# Altium schematic sheet USB_UART.SchDoc
size A; SheetNumber: 3; SheetTotal: 5
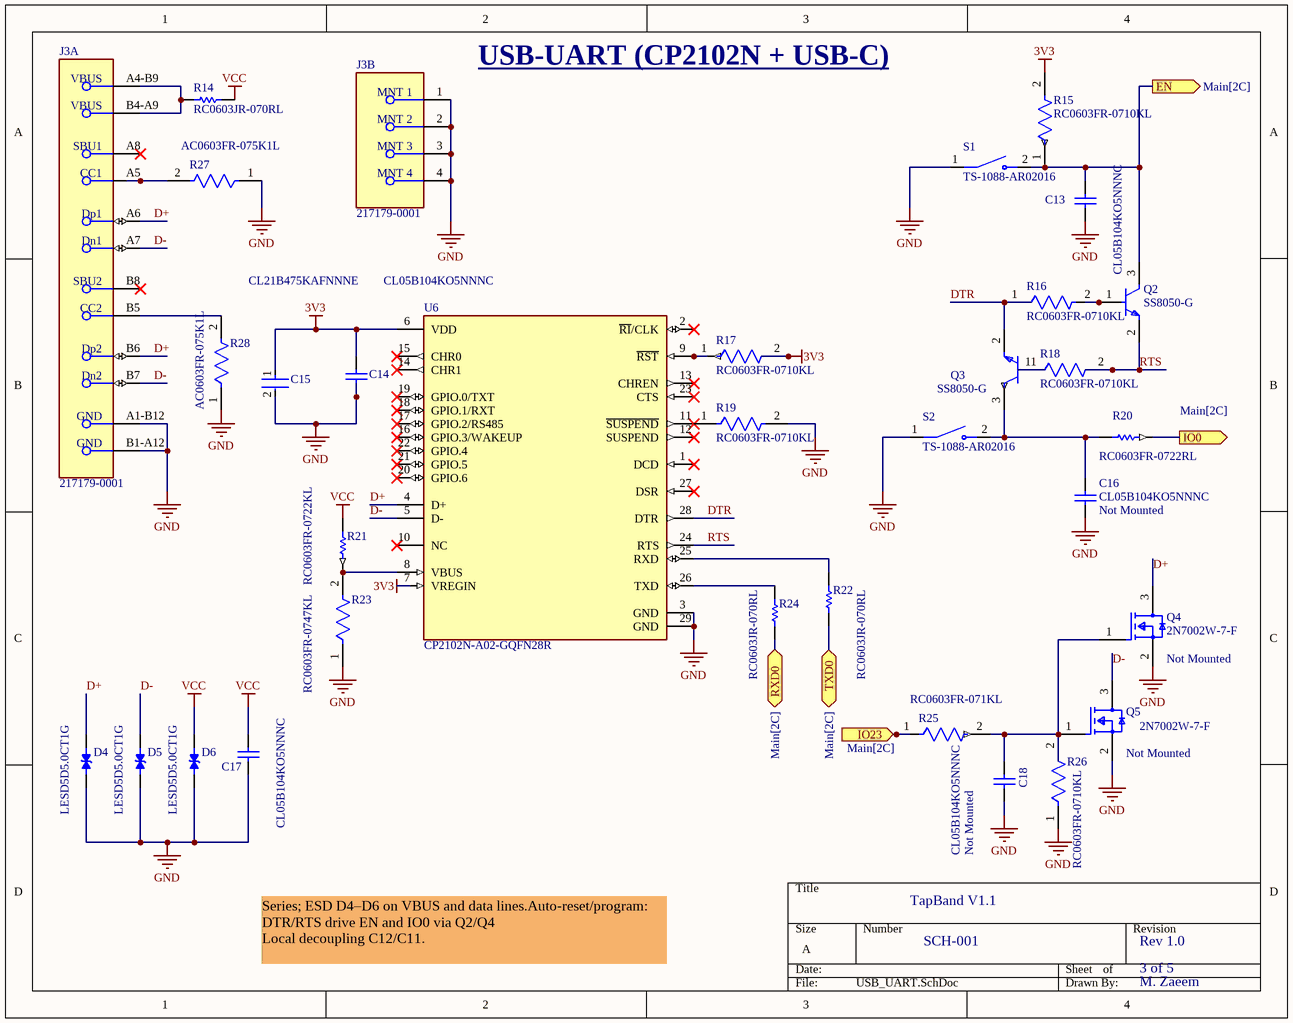
[diagram p0: USB_UART.SchDoc]

## Parts
C13  CL05B104KO5NNNC  [CAPC1050X55X23ML05T13]
C14  CL05B104KO5NNNC  [CAPC1050X55X23ML05T13]
C15  CL21B475KAFNNNE  [FP-CL21-IPC_C]
C16  CL05B104KO5NNNC  Fitted: Not Mounted  [CAPC1050X55X23ML05T13]
C17  CL05B104KO5NNNC  [CAPC1050X55X23ML05T13]
C18  CL05B104KO5NNNC  Fitted: Not Mounted  [CAPC1050X55X23ML05T13]
D4  LESD5D5.0CT1G  [TVS_LESD5D5.0CT1G]
D5  LESD5D5.0CT1G  [TVS_LESD5D5.0CT1G]
D6  LESD5D5.0CT1G  [TVS_LESD5D5.0CT1G]
J3  217179-0001  [FP-2171790001-MFG]  (parts A,B of 2)
Q2  SS8050-G  [FP-SS8050-G-MFG]
Q3  SS8050-G  [FP-SS8050-G-MFG]
Q4  2N7002W-7-F  Fitted: Not Mounted  [FP-SOT323-IPC_C]
Q5  2N7002W-7-F  Fitted: Not Mounted  [FP-SOT323-IPC_C]
R14  RC0603JR-070RL  [RESC1608X55X25ML10T15]
R15  RC0603FR-0710KL  [FP-RC0603-0_55-IPC_C]
R16  RC0603FR-0710KL  [FP-RC0603-0_55-IPC_C]
R17  RC0603FR-0710KL  [FP-RC0603-0_55-IPC_C]
R18  RC0603FR-0710KL  [FP-RC0603-0_55-IPC_C]
R19  RC0603FR-0710KL  [FP-RC0603-0_55-IPC_C]
R20  RC0603FR-0722RL  [RESC1608X55X25NL10T15]
R21  RC0603FR-0722KL  [RESC1608X55X25LL10T15]
R22  RC0603JR-070RL  [RESC1608X55X25ML10T15]
R23  RC0603FR-0747KL  [FP-RC0603FR-0747KL-MFG]
R24  RC0603JR-070RL  [RESC1608X55X25ML10T15]
R25  RC0603FR-071KL  [FP-RC0603-0_55-IPC_C]
R26  RC0603FR-0710KL  [FP-RC0603-0_55-IPC_C]
R27  AC0603FR-075K1L  [FP-AC0603-MFG]
R28  AC0603FR-075K1L  [FP-AC0603-MFG]
S1  TS-1088-AR02016  [SW_TS-1088-AR02016]
S2  TS-1088-AR02016  [SW_TS-1088-AR02016]
U6  CP2102N-A02-GQFN28R  [FP-CP2102N-A02-GQFN28R-MFG]

## Ports
EN (out, see Main[2C]), IO0 (out, see Main[2C]), IO23 (in, see Main[2C]), RXD0 (bidir, see Main[2C]), TXD0 (bidir, see Main[2C])

## Nets
3V3: C14.2 C15.1 R15.2 R17.2 U6.6(VDD) U6.7(VREGIN)
GND: C13.1 C14.1 C15.2 C16.2 C17.1 C18.1 D4.2 D5.2 D6.2 J3.1(MNT_1) J3.2(MNT_2) J3.3(MNT_3) J3.4(MNT_4) J3.A1-B12(GND) J3.B1-A12(GND) Q4.2(S) Q5.2(S) R19.2 R23.1 R26.1 R27.1 R28.1 S1.1 S2.1 U6.3(GND) U6.29(GND)
VCC: C17.2 D6.1 R14.1 R21.1
D+: D4.1 J3.A6(Dp1) J3.B6(Dp2) Q4.3(D) U6.4(D+)
D-: D5.1 J3.A7(Dn1) J3.B7(Dn2) Q5.3(D) U6.5(D-)
DTR: Q3.2(E) R16.1 U6.28(DTR)
EN: C13.2 Q2.3(C) R15.1 S1.2 ; port EN
IO0: R20.2 ; port IO0
IO23: R25.1 ; port IO23
RTS: Q2.2(E) R18.2 U6.24(RTS)
RXD0: R24.1 ; port RXD0
TXD0: R22.1 ; port TXD0
NetC16_1: C16.1 Q3.3(C) R20.1 S2.2
NetC18_2: C18.2 Q4.1(G) Q5.1(G) R25.2 R26.2
NetJ3_A4-B9: J3.A4-B9(VBUS) J3.B4-A9(VBUS) R14.2
NetJ3_A5: J3.A5(CC1) R27.2
NetJ3_B5: J3.B5(CC2) R28.2
NetQ2_1: Q2.1(B) R16.2
NetQ3_1: Q3.1(B) R18.1
NetR17_1: R17.1 U6.9(~{RST})
NetR19_1: R19.1 U6.11(~{SUSPEND})
NetR21_2: R21.2 R23.2 U6.8(VBUS)
NetR22_2: R22.2 U6.25(RXD)
NetR24_2: R24.2 U6.26(TXD)

Not connected (* = marked no-connect by the designer): J3 A8(SBU1)* B8(SBU2)*; U6 1(DCD)* 2(~{RI}/CLK)* 10(NC)* 12(SUSPEND)* 13(CHREN)* 14(CHR1)* 15(CHR0)* 16(GPIO.3/WAKEUP)* 17(GPIO.2/RS485)* 18(GPIO.1/RXT)* 19(GPIO.0/TXT)* 20(GPIO.6)* 21(GPIO.5)* 22(GPIO.4)* 23(CTS)* 27(DSR)*

## Notes on the sheet
- USB‑UART (CP2102N + USB‑C)
- TapBand V1.1
- Series; ESD D4–D6 on VBUS and data lines.Auto‑reset/program: DTR/RTS drive EN and IO0 via Q2/Q4
  Local decoupling C12/C11.
- SCH-001
- Rev 1.0
- 3 of 5
- M. Zaeem

## Library data of the parts
C13 C14 C16-C18 = CMP-2000-05439-1: Chip Capacitor, 100 nF, +/- 10%, 16 V, -55 to 125 degC, 0402 (1005 Metric), RoHS, Tape and Reel; Manufacturer: Samsung Electro-Mechanics; Capacitance: 100000pF; Dielectric: X7R; Rated Voltage: 16V; Case Size/Dimension: 0402; Tolerance (%): ±10%; Manufacturer URL: http://www.samsungsem.com/global/index.jsp; Datasheet URL: https://datasheet.ciiva.com/29198/458718-da-01-en-vs-kondensator-0402-29198423.pdf; Datasheet Version: Nov-10
C15 = CMP-13271-001003-1: CL21 Series 0805 4.7uF 25V ±10% Tolerance X7R Multilayer Ceramic Chip Capacitor; Length: 0.079inch; Capacitance: 4.7uF; Max Operating Temperature: 125°C; Mount: Surface Mount; Voltage Rating (DC): 25V; Width: 0.049inch; Min Operating Temperature: -55°C; Lead Free: Lead Free; Case Code (Metric): 2012; Case/Package: 0805; Case Code (Imperial): 0805; Tolerance: 10%; Thickness: 0.053inch; Voltage Rating: 25V; Packaging: Tape and Reel
D4-D6 = LESD5D5.0CT1G: Transient Voltage Suppressors for ESD Protection; MF: Leshan Radio Co.; Check_prices: https://www.snapeda.com/parts/LESD5D5.0CT1G/Leshan+Radio+Co./view-part/?ref=eda; Value: *; Availability: Not in stock; Package: None; SnapEDA_Link: https://www.snapeda.com/parts/LESD5D5.0CT1G/Leshan+Radio+Co./view-part/?ref=snap; MP: LESD5D5.0CT1G; Price: None
J3 = CMP-04767-000028-2: CONN RCP USB2.0 TYP C 24P SMD RA; NexarPartId: 117190526; Gender: Receptacle; Number of Contacts: 16; Current Rating: 1.25A; Voltage Rating: 30V; Min Operating Temperature: -40°C; USB Standard: USB 2.0; Height: 3.36mm; Contact Material: Gold, Nickel; Max Operating Temperature: 85°C
Q2 Q3 = CMP-20235-000001-1: NPN TRANSISTOR 1.5A 40V SOT-23 R; Transition Frequency: 100MHz; Max Breakdown Voltage: 25V; Collector Emitter Voltage (VCEO): 400mV; Max Power Dissipation: 300mW; Max Collector Current: 1.5A; Case/Package: TO-236-3; Packaging: Tape and Reel; RoHS Compliant: Yes; Mount: Surface Mount; Collector Emitter Breakdown Voltage: 25V
Q4 Q5 = CMP-2000-05568-2: MOSFET N-CH 60V 115MA SOT323; Element Configuration: Single; Nominal Vgs: 2V; Drain to Source Breakdown Voltage: 70V; Drain to Source Resistance: 2.6R; Input Capacitance: 50pF; On-State Resistance: 7.5R; Number of Channels: 1; Power Dissipation: 200mW; Turn-Off Delay Time: 11ns; Turn-On Delay Time: 7ns; Gate to Source Voltage (Vgs): 20V; Dual Supply Voltage: 60V; Contact Plating: Tin; Min Operating Temperature: -55°C; Radiation Hardening: No; Drain to Source Voltage (Vdss): 60V; Height: 1mm; Max Operating Temperature: 150°C; Voltage Rating (DC): 60V; Case/Package: SOT-323; Weight: 0.000212oz; Mount: Surface Mount; Length: 2.2mm; Lead Free: Lead Free; Threshold Voltage: 2V; Packaging: Tape and Reel; Max Power Dissipation: 200mW; Package Quantity: 1; Continuous Drain Current (ID): 115mA; Number of Pins: 3; Width: 1.35mm; Current Rating: 115mA; Rds On Max: 7.5R; REACH SVHC: No SVHC; Termination: SMD/SMT; Number of Elements: 1
R14 R22 R24 = CMP-2100-03667-1: Chip Resistor, 0 Ohm, +/- 5%, 0.1 W, -55 to 155 degC, 0603 (1608 Metric), RoHS, Tape and Reel; Manufacturer: Yageo; Temperature Coefficient: 200ppm/degreesC; Voltage Rating: 50V; Power Rating: 100mW; Resistance: 0mOhm; Width: 0.8mm; Max Operating Temperature: 155degC; Tolerance: 5%; Package Reference: 0603; Height: 0.45mm; Depth: 0.8mm; Package Description: 2-Pin Surface Mount Device, Body 1.6 x 0.8 mm; Termination: SMD/SMT; Package Quantity: 5000; Case/Package: 0603; Case Code (Imperial): 0603; Radiation Hardening: No; Number of Pins: 2; Length: 1.6mm; Lead Free: LeadFree; Voltage Rating (DC): 50V; Military Standard: Not; Datasheet URL: http://www.yageo.com/NewPortal/yageodocoutput?fileName=/pdf/R-Chip/PYu-RC_Group_51_RoHS_L_5.pdf; Manufacturer URL: http://www.yageo.com/; Packaging: TapeandReel; Case Code (Metric): 1608; Min Operating Temperature: -55degC; Composition: ThickFilm; RoHSCompliant: true; Contact Plating: Tin; Datasheet Version: Rev. 5, 10/2016; REACH SVHC: NoSVHC
R15-R19 R26 = CMP-2100-03664-2: RES 10K OHM 1% 1/10W 0603; Voltage Rating: 75V; Voltage Rating (DC): 50V; Resistance: 10kR; Power Rating: 100mW; Temperature Coefficient: 100ppm/°C; Depth: 0.8mm; Termination: SMD/SMT; Resistor Type: Thick Film; Series: RC; Construction: Rectangular; Features: Moisture Resistant; Packaging: Tape and Reel; Min Operating Temperature: -55°C; Number of Terminations: 2; Lead Pitch: 0.3mm; RoHS Compliant: Yes; Case/Package: 0603; Resistance Tolerance: 1%; Military Standard: Not; Weight: 7.1E-05oz; Number of Pins: 2; Tolerance: 1%; Length: 1.6mm; Case Code (Imperial): 0603; Lead Free: Lead Free; Width: 0.8mm; Max Power Dissipation: 100mW; Height: 0.45mm; Max Operating Temperature: 155°C; Case Code (Metric): 1608; Size Code: 0603
R20 = CMP-1659-00033-1: Chip Resistor, 22 Ohm, +/- 1%, 0.1 W, -55 to 155 degC, 0603 (1608 Metric), RoHS, Tape and Reel; Max Ouput Current: 8 A; Case\Package: SIP; Max Input Voltage: 1.4 V; ComponentLink2URL: http://www.yageo.com/documents/recent/PYu-RC_Group_51_RoHS_L_04.pdf; RoHSCompliant: true; Max Operating Temperature: 100 degC; PackageDescription: 2-Pin Surface Mount Device, Body 1.6 x 0.8 mm; ComponentLink1Description: Manufacturer URL; ComponentLink1URL: http://www.yageo.com/; Length: 18.5 mm; REACH SVHC: Unknown; Pins: 4; DatasheetVersion: Rev. 4, 02/2016; PackageReference: 0603; Output Current: 8 A; Min Operating Temperature: -25 degC; Height: 19.6 mm; Mount: Through Hole; Radiation Hardening: No; ComponentLink2Description: Datasheet; Package Quantity: 200; Packaging: Rail/Tube
R21 = CMP-1012-00659-3: Chip Resistor, 22 KOhm, +/- 1%, 0.1 W, -55 to 155 degC, 0603 (1608 Metric), RoHS, Tape and Reel; Tolerance: 10%; Current Rating: 290 mA; Shielding: Unshielded; Resistance: 2.9 Ohm; PackageReference: 0603; PackageDescription: 2-Pin Surface Mount Device, Body 1.6 x 0.8 mm; ComponentLink2URL: http://www.yageo.com/documents/recent/PYu-RC_Group_51_RoHS_L_04.pdf; RoHSCompliant: True; REACH SVHC: No SVHC; ComponentLink1Description: Manufacturer URL; ComponentLink2Description: Datasheet; DatasheetVersion: Rev. 4, 02/2016; Min Operating Temperature: -55degC; Pins: 2; Mount: Through Hole; Height: 11 mm; Packaging: Bulk; Radiation Hardening: No; Package Quantity: 100; Diameter: 8.5 mm; Lead Pitch: 5 mm; Case/Package: Radial; Max Operating Temperature: 105degC; ComponentLink1URL: http://www.yageo.com/
R23 = CMP-1659-00055-2: RES SMD 47K OHM 1% 1/10W 0603; Voltage Rating: 50V; Temperature Coefficient: 100ppm/°C; Max Power Dissipation: 100mW; Resistance: 47kR; Voltage Rating (DC): 50V; Min Operating Temperature: -55°C; Packaging: Tape and Reel; Features: Moisture Resistant; Termination: SMD/SMT; Technology: THICK FILM; Lead Free: Lead Free; Max Operating Temperature: 155°C; Width: 0.031inch; Case Code (Metric): 1608; Tolerance: 1%; Package Quantity: 1; Resistor Type: Thick Film; RoHS Compliant: Yes; Case/Package: 0603; Case Code (Imperial): 0603; Resistance Tolerance: 1%; Length: 0.063inch; Series: RC; Number of Pins: 2; Power Rating: 100mW; Number of Terminations: 2; Construction: Rectangular; Height: 0.022inch; Military Standard: Not; Size Code: 0603; Depth: 0.8mm
R25 = CMP-1659-00009-5: RES 1K OHM 1% 1/10W 0603; Resistance: 1kR; Voltage Rating: 50V; Power Rating: 100mW; Temperature Coefficient: 100ppm/°C; Military Standard: Not; REACH SVHC: No SVHC; Size Code: 0603; Features: Moisture Resistant; Number of Terminations: 2; Technology: THICK FILM; Series: RC; Case Code (Metric): 1608; Resistance Tolerance: 1%; Resistor Type: Thick Film; Termination: SMD/SMT; Contact Plating: Tin; Radiation Hardening: No; Min Operating Temperature: -55°C; Max Operating Temperature: 155°C; Packaging: Tape and Reel; Max Power Dissipation: 100mW; RoHS Compliant: Yes; Height: 0.45mm; Lead Free: Lead Free; Case/Package: 0603; Length: 1.6mm; Tolerance: 1%; Case Code (Imperial): 0603; Construction: Rectangular; Depth: 0.8mm
R27 R28 = CMP-03412-025080-2: RES 5.1KΩ 1.00% 0.1W 0603; Voltage Rating: 50V; Temperature Coefficient: 100ppm/°C; Resistance: 5.1kR; Max Power Dissipation: 100mW; Tolerance: 1%; Max Operating Temperature: 155°C; Min Operating Temperature: -55°C; Ratings: AEC-Q200; Features: Moisture Resistant; RoHS Compliant: Yes; Number of Terminations: 2; Weight: 7.1E-05oz; Case Code (Imperial): 0603; Resistor Type: Thick Film; Length: 1.6mm; Termination: SMD/SMT; Case Code (Metric): 1608; Packaging: Tape and Reel; Width: 0.8mm; Series: AC; Case/Package: 0603; Power Rating: 100mW; Height: 0.45mm
S1 S2 = TS-1088-AR02016: 50mA 4mm 100MÎ© 100,000 Times 12V 160gf 3mm 2mm Round Button Vertical welding SPST SMD Tactile Switches ROHS; MF: Xunpu; SnapEDA_Link: https://www.snapeda.com/parts/TS-1088-AR02016/Xunpu/view-part/?ref=snap; Package: Package; Value: *; MP: TS-1088-AR02016; Check_prices: https://www.snapeda.com/parts/TS-1088-AR02016/Xunpu/view-part/?ref=eda
U6 = CMP-08093-000007-1: IC USB TO UART BRIDGE QFN28